# EAGLE schematic CGScale (EAGLE 9.6.2)
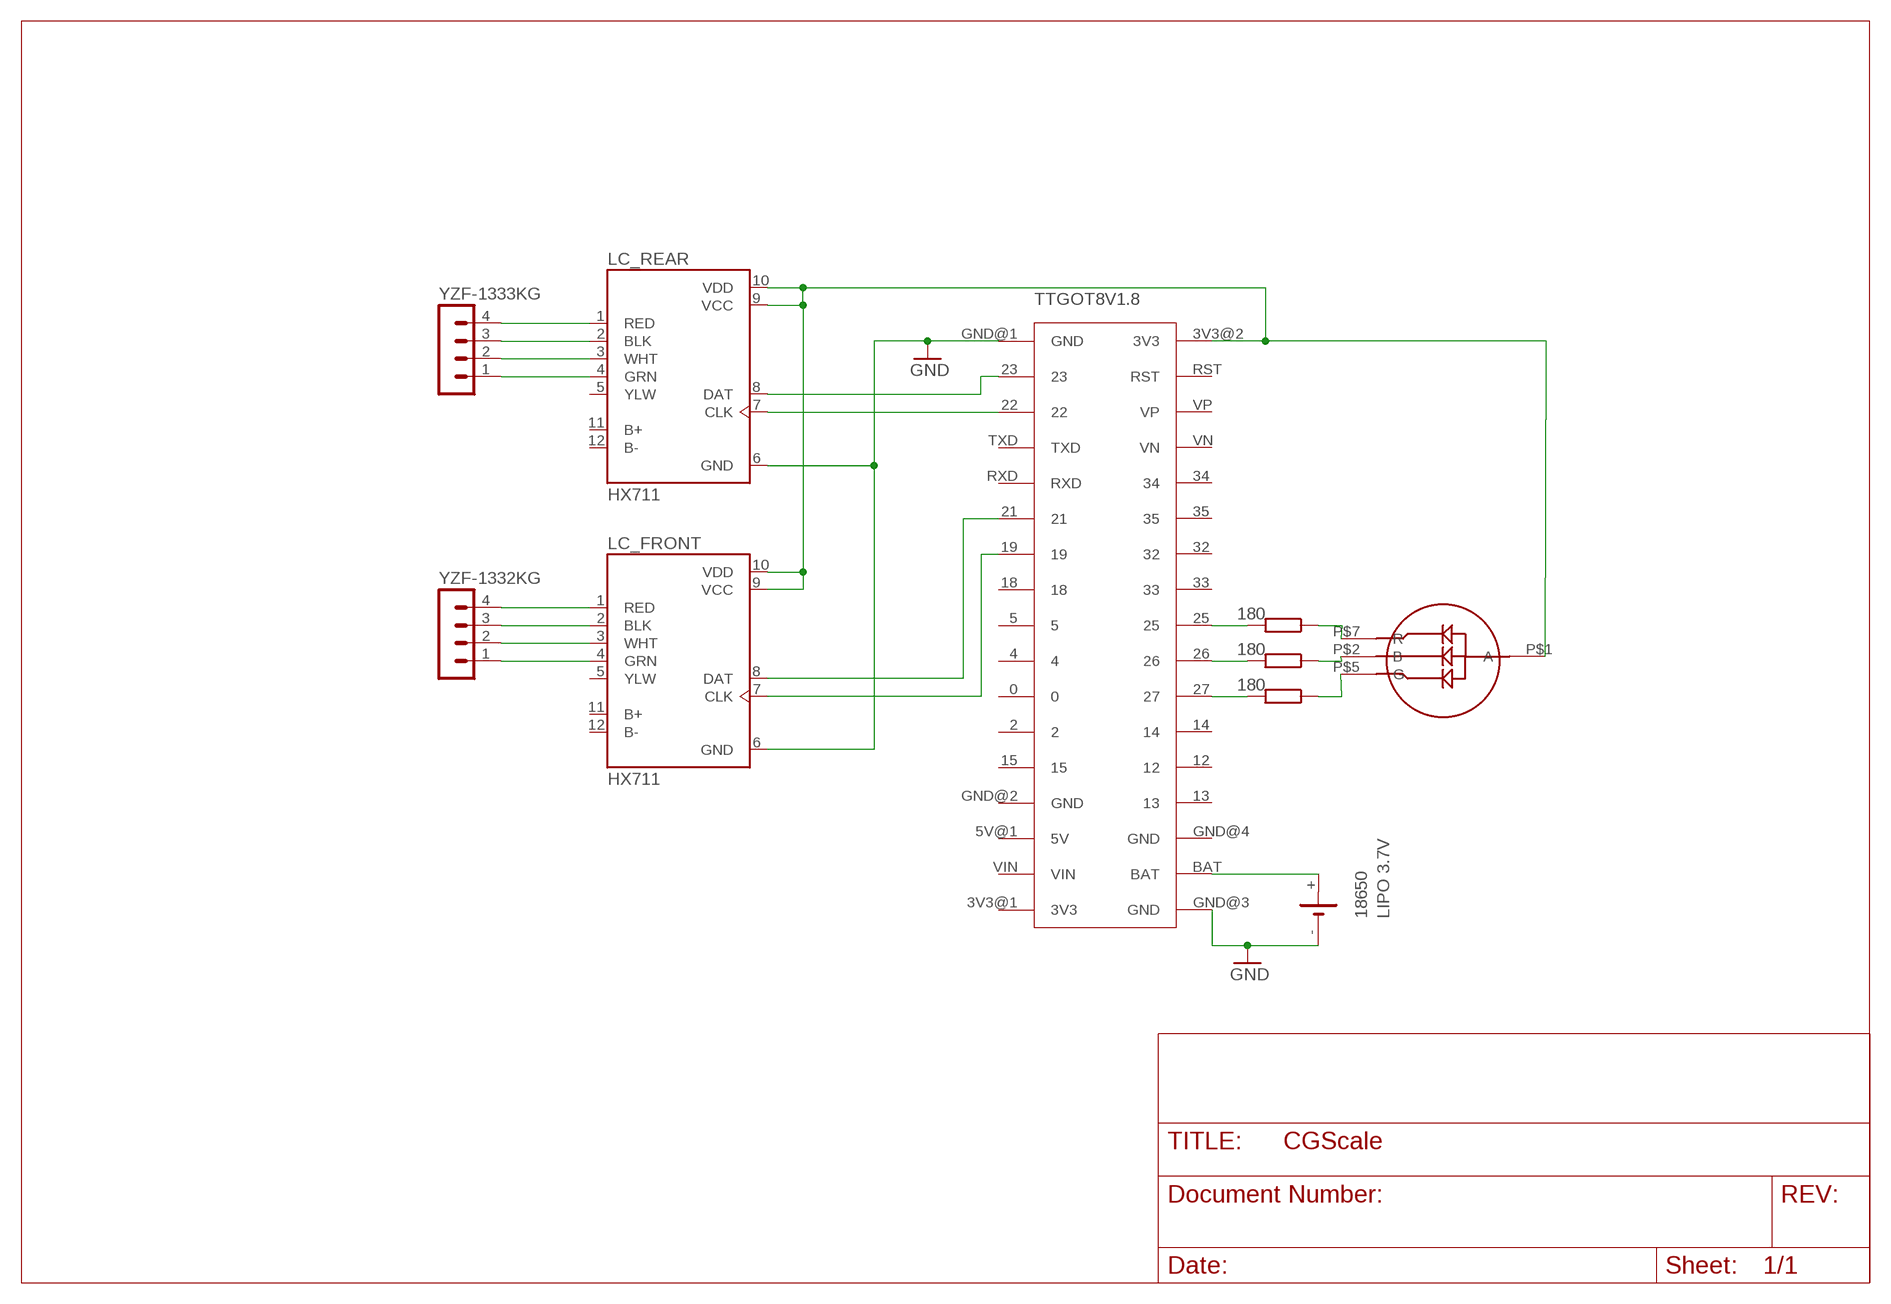
[diagram p0: schematic, sheet 1]
R1 (R): R1: 180
R2 (R): R2: 180
R3 (R): R3: 180

## Parts
18650  LIPO 3.7V  SL-150-1/2AA/PR  [SL-150-1/2AA/PR]
LC_FRONT  HX711  SEN-13879  [SPARKFUN_SEN-13879]
LC_REAR  HX711  SEN-13879  [SPARKFUN_SEN-13879]
RGB_LED  LED-4_PIN  [LED-4_PIN]
TTGOT8V1.8  TTGO-T8_V18  [TTGO-T8_V18]
YZF-1332KG  MA04-1  [MA04-1]
YZF-1333KG  MA04-1  [MA04-1]

## Nets
GND: 18650.- LC_FRONT.6(GND) LC_REAR.6(GND) TTGOT8V1.8.GND@1(GND) TTGOT8V1.8.GND@3(GND)
N$1: TTGOT8V1.8.25
N$2: TTGOT8V1.8.26
N$3: TTGOT8V1.8.27
N$4: RGB_LED.P$5(G)
N$5: RGB_LED.P$2(B)
N$6: RGB_LED.P$7(R)
N$7: LC_REAR.8(DAT) TTGOT8V1.8.23
N$8: LC_REAR.7(CLK) TTGOT8V1.8.22
N$9: LC_FRONT.8(DAT) TTGOT8V1.8.21
N$10: LC_FRONT.7(CLK) TTGOT8V1.8.19
N$11: LC_FRONT.9(VCC) LC_FRONT.10(VDD) LC_REAR.9(VCC) LC_REAR.10(VDD) RGB_LED.P$1(A) TTGOT8V1.8.3V3@2(3V3)
N$12: LC_FRONT.1(RED) YZF-1332KG.4
N$13: LC_FRONT.3(WHT) YZF-1332KG.2
N$14: LC_FRONT.4(GRN) YZF-1332KG.1
N$15: LC_REAR.1(RED) YZF-1333KG.4
N$16: LC_REAR.2(BLK) YZF-1333KG.3
N$17: LC_FRONT.2(BLK) YZF-1332KG.3
N$18: LC_REAR.3(WHT) YZF-1333KG.2
N$19: LC_REAR.4(GRN) YZF-1333KG.1
N$20: 18650.+ TTGOT8V1.8.BAT
Unconnected: LC_FRONT.5(YLW) LC_FRONT.11(B+) LC_FRONT.12(B-) LC_REAR.5(YLW) LC_REAR.11(B+) LC_REAR.12(B-) TTGOT8V1.8.0 TTGOT8V1.8.2 TTGOT8V1.8.3V3@1(3V3) TTGOT8V1.8.4 TTGOT8V1.8.5 TTGOT8V1.8.5V@1(5V) TTGOT8V1.8.12 TTGOT8V1.8.13 TTGOT8V1.8.14 TTGOT8V1.8.15 TTGOT8V1.8.18 TTGOT8V1.8.32 TTGOT8V1.8.33 TTGOT8V1.8.34 TTGOT8V1.8.35 TTGOT8V1.8.GND@2(GND) TTGOT8V1.8.GND@4(GND) TTGOT8V1.8.RST TTGOT8V1.8.RXD TTGOT8V1.8.TXD TTGOT8V1.8.VIN TTGOT8V1.8.VN TTGOT8V1.8.VP

## Library data of the parts
18650 = battery:SL-150-1/2AA/PR: LI BATTERY Sonnenschein
LC_FRONT LC_REAR = SEN-13879:SEN-13879: Load Cell Amp Hx711 Check availability <https://pricing.snapeda.com/parts/SEN-13879/SparkFun/view-part?ref=eda>; AVAILABILITY: In Stock; DESCRIPTION: External Input Sensor Amplifier -; MF: SparkFun; MP: SEN-13879; PACKAGE: None; PRICE: None; PURCHASE-URL: https://pricing.snapeda.com/search/part/SEN-13879/?ref=eda
RGB_LED = RGB-Led:LED-4_PIN
TTGOT8V1.8 = TTGO-T8:TTGO-T8_V18: TTGO T8 V1.8
YZF-1332KG YZF-1333KG = con-lstb:MA04-1: PIN HEADER; OC_FARNELL: unknown; OC_NEWARK: unknown